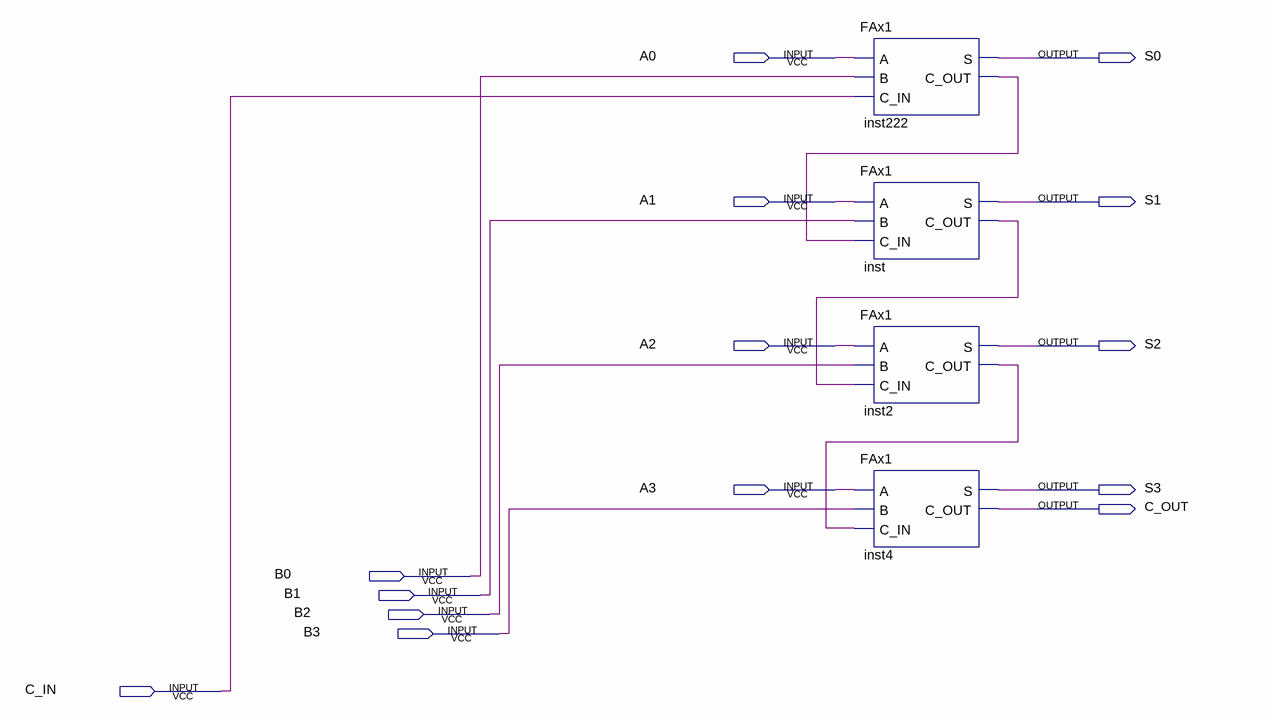
[diagram p0: schematic sheet]
// Quartus schematic FAx4.bdf as structural Verilog: 4 symbols, 14 pins
module FAx4 (
  input  A0,
  input  A1,
  input  A2,
  input  A3,
  input  B0,
  input  B1,
  input  B2,
  input  B3,
  input  C_IN,
  output S0,
  output S1,
  output S2,
  output S3,
  output C_OUT
);

  wire inst2_c_out, inst222_c_out, inst_c_out;

  FAx1 inst222 (.A(A0), .B(B0), .C_IN(C_IN), .S(S0), .C_OUT(inst222_c_out));
  FAx1 inst (.A(A1), .B(B1), .C_IN(inst222_c_out), .S(S1), .C_OUT(inst_c_out));
  FAx1 inst2 (.A(A2), .B(B2), .C_IN(inst_c_out), .S(S2), .C_OUT(inst2_c_out));
  FAx1 inst4 (.A(A3), .B(B3), .C_IN(inst2_c_out), .S(S3), .C_OUT(C_OUT));
endmodule
